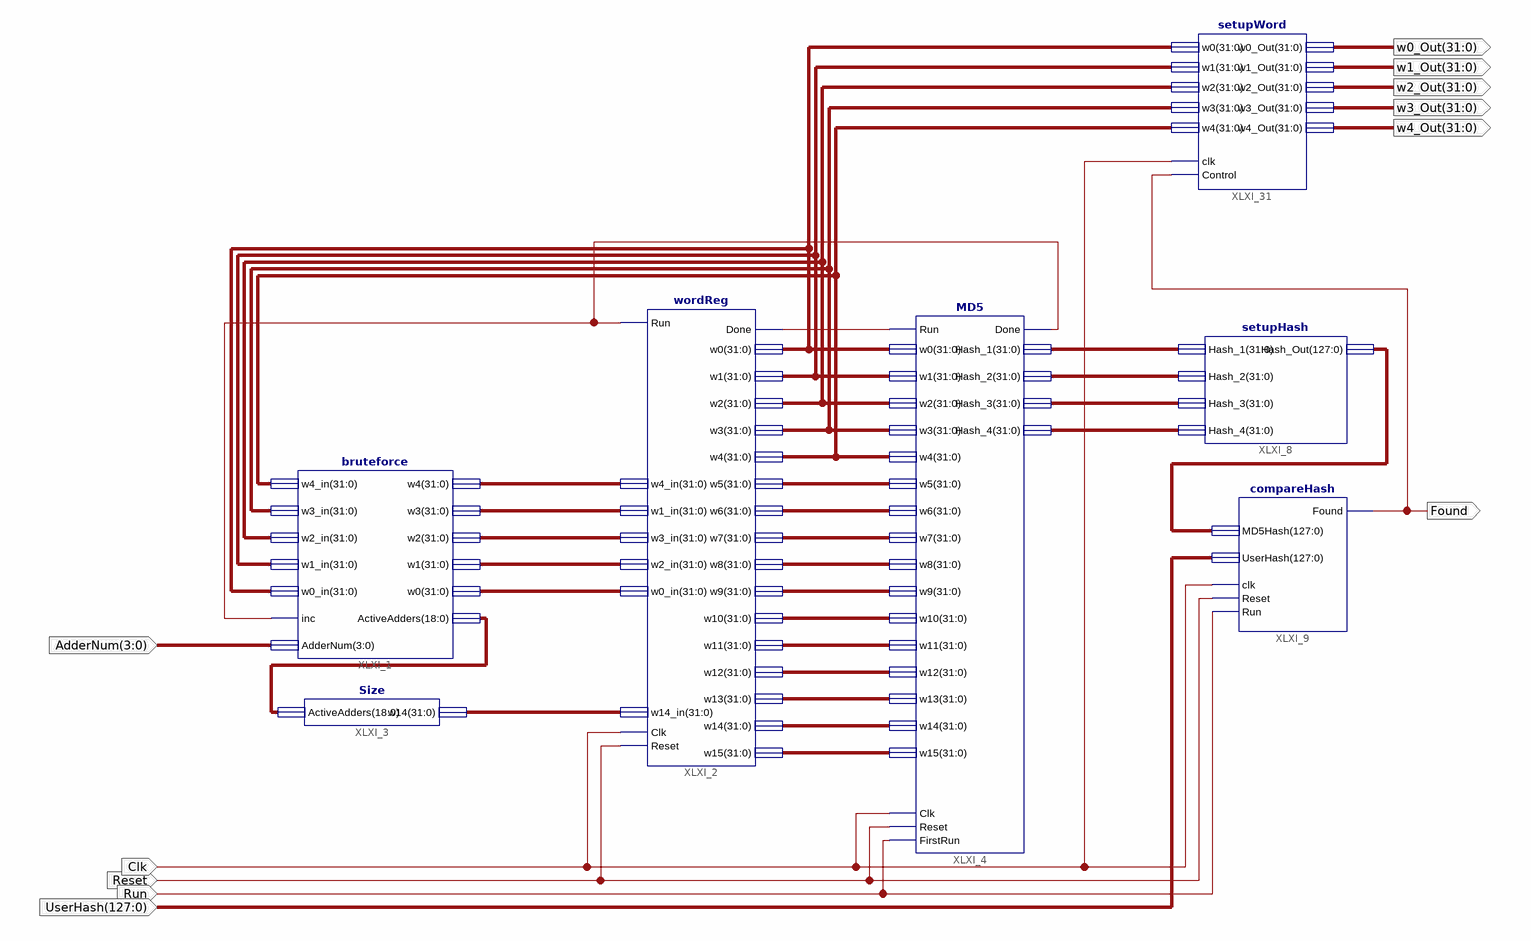
[diagram p0: schematic sheet 1]
// Xilinx ISE schematic MD5_Crack.sch (spartan3a) as structural Verilog: 7 symbols, 11 ports
module MD5_Crack (
  input  [3:0] AdderNum,
  input  Reset,
  input  Clk,
  input  Run,
  input  [127:0] UserHash,
  output Found,
  output [31:0] w0_Out,
  output [31:0] w3_Out,
  output [31:0] w2_Out,
  output [31:0] w4_Out,
  output [31:0] w1_Out
);

  wire XLXN_28, XLXN_1337;
  wire [18:0] XLXN_1;
  wire [31:0] XLXN_3, XLXN_4, XLXN_5, XLXN_6, XLXN_7, XLXN_8, XLXN_9, XLXN_11, XLXN_13, XLXN_15, XLXN_17,
       XLXN_30, XLXN_31, XLXN_32, XLXN_34, XLXN_143, XLXN_144, XLXN_145, XLXN_146, XLXN_147, XLXN_148,
       XLXN_149, XLXN_150, XLXN_151, XLXN_152, XLXN_153;
  wire [127:0] XLXN_41;

  bruteforce XLXI_1 (
    .w4_in(XLXN_9), .w3_in(XLXN_11), .w2_in(XLXN_13), .w1_in(XLXN_15), .w0_in(XLXN_17), .inc(XLXN_1337),
    .AdderNum(AdderNum), .w4(XLXN_7), .w3(XLXN_6), .w2(XLXN_5), .w1(XLXN_4), .w0(XLXN_3),
    .ActiveAdders(XLXN_1));
  wordReg XLXI_2 (
    .w0(XLXN_17), .w1(XLXN_15), .w2(XLXN_13), .w3(XLXN_11), .w4(XLXN_9), .w5(XLXN_143), .w6(XLXN_144),
    .w7(XLXN_145), .w8(XLXN_146), .w9(XLXN_147), .w10(XLXN_148), .w11(XLXN_149), .w12(XLXN_150),
    .w13(XLXN_151), .w14(XLXN_152), .w15(XLXN_153), .w4_in(XLXN_7), .w1_in(XLXN_6), .w3_in(XLXN_5),
    .w2_in(XLXN_4), .w0_in(XLXN_3), .w14_in(XLXN_8), .Reset(Reset), .Clk(Clk), .Run(XLXN_1337), .Done(XLXN_28));
  Size XLXI_3 (.ActiveAdders(XLXN_1), .w14(XLXN_8));
  MD5 XLXI_4 (
    .Done(XLXN_1337), .w0(XLXN_17), .w1(XLXN_15), .w2(XLXN_13), .w3(XLXN_11), .w4(XLXN_9), .w5(XLXN_143),
    .w6(XLXN_144), .w7(XLXN_145), .w8(XLXN_146), .w9(XLXN_147), .w10(XLXN_148), .w11(XLXN_149),
    .w12(XLXN_150), .w13(XLXN_151), .w14(XLXN_152), .w15(XLXN_153), .Run(XLXN_28), .Clk(Clk), .Reset(Reset),
    .FirstRun(Run), .Hash_1(XLXN_30), .Hash_2(XLXN_31), .Hash_3(XLXN_32), .Hash_4(XLXN_34));
  setupHash XLXI_8 (.Hash_1(XLXN_30), .Hash_2(XLXN_31), .Hash_3(XLXN_32), .Hash_4(XLXN_34), .Hash_Out(XLXN_41));
  compareHash XLXI_9 (.Found(Found), .MD5Hash(XLXN_41), .UserHash(UserHash), .clk(Clk), .Reset(Reset), .Run(Run));
  setupWord XLXI_31 (
    .w0_Out(w0_Out), .w1_Out(w1_Out), .w2_Out(w2_Out), .w3_Out(w3_Out), .w4_Out(w4_Out), .clk(Clk),
    .Control(Found), .w4(XLXN_9), .w3(XLXN_11), .w2(XLXN_13), .w1(XLXN_15), .w0(XLXN_17));
endmodule
